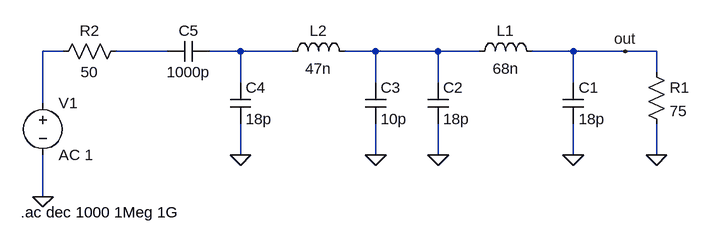
[diagram p0: schematic matching.asc]
matching.asc, the LTspice schematic file:
Version 4
SHEET 1 880 680
WIRE -592 112 -624 112
WIRE -432 112 -512 112
WIRE -320 112 -368 112
WIRE -240 112 -320 112
WIRE -112 112 -160 112
WIRE -16 112 -112 112
WIRE 48 112 -16 112
WIRE 192 112 128 112
WIRE 272 112 192 112
WIRE 320 112 272 112
WIRE 320 144 320 112
WIRE -320 160 -320 112
WIRE -112 160 -112 112
WIRE -16 160 -16 112
WIRE 192 160 192 112
WIRE -624 192 -624 112
WIRE -320 272 -320 224
WIRE -112 272 -112 224
WIRE -16 272 -16 224
WIRE 192 272 192 224
WIRE 320 272 320 224
WIRE -624 336 -624 272
FLAG 320 272 0
FLAG 192 272 0
FLAG -16 272 0
FLAG -112 272 0
FLAG -320 272 0
FLAG -624 336 0
FLAG 272 112 out
SYMBOL res 304 128 R0
SYMATTR InstName R1
SYMATTR Value 75
SYMBOL cap 176 160 R0
SYMATTR InstName C1
SYMATTR Value 18p
SYMBOL ind 32 128 R270
WINDOW 0 32 56 VTop 2
WINDOW 3 5 56 VBottom 2
SYMATTR InstName L1
SYMATTR Value 68n
SYMATTR SpiceLine Rser=0.01
SYMBOL cap -32 160 R0
SYMATTR InstName C2
SYMATTR Value 18p
SYMBOL cap -128 160 R0
SYMATTR InstName C3
SYMATTR Value 10p
SYMBOL ind -256 128 R270
WINDOW 0 32 56 VTop 2
WINDOW 3 5 56 VBottom 2
SYMATTR InstName L2
SYMATTR Value 47n
SYMATTR SpiceLine Rser=0.01
SYMBOL cap -336 160 R0
SYMATTR InstName C4
SYMATTR Value 18p
SYMBOL cap -368 96 R90
WINDOW 0 0 32 VBottom 2
WINDOW 3 32 32 VTop 2
SYMATTR InstName C5
SYMATTR Value 1000p
SYMBOL res -496 96 R90
WINDOW 0 0 56 VBottom 2
WINDOW 3 32 56 VTop 2
SYMATTR InstName R2
SYMATTR Value 50
SYMBOL voltage -624 176 R0
SYMATTR InstName V1
SYMATTR Value AC 1
TEXT -658 360 Left 2 !.ac dec 1000 1Meg 1G

The netlist it stands for:
* matching.asc
R1 out 0 75
C1 out 0 18p
L1 N004 out 68n Rser=0.01
C2 N004 0 18p
C3 N004 0 10p
L2 N003 N004 47n Rser=0.01
C4 N003 0 18p
C5 N003 N002 1000p
R2 N002 N001 50
V1 N001 0 AC 1
.ac dec 1000 1Meg 1G
.backanno
.end